# Altium schematic sheet LPCB235 - SPI UART - GROUP B1.SchDoc
size A3; Address1: Factory 10; Address2: 9-13 Dingley Avenue, Dandeong, VICTORIA 3175, AUSTRALIA; DocumentNumber: 36; Revision: 1; SheetNumber: 36; SheetTotal: 37; Lockie__PCB_SUB_ASSEMBLY: SPI UARTS B1; Lockie__PCB_ASSEMBLY: FCU PCB; Lockie__LDL: LPCB235; Lockie__PCB_DESCRIPTION: Flight Control Unit
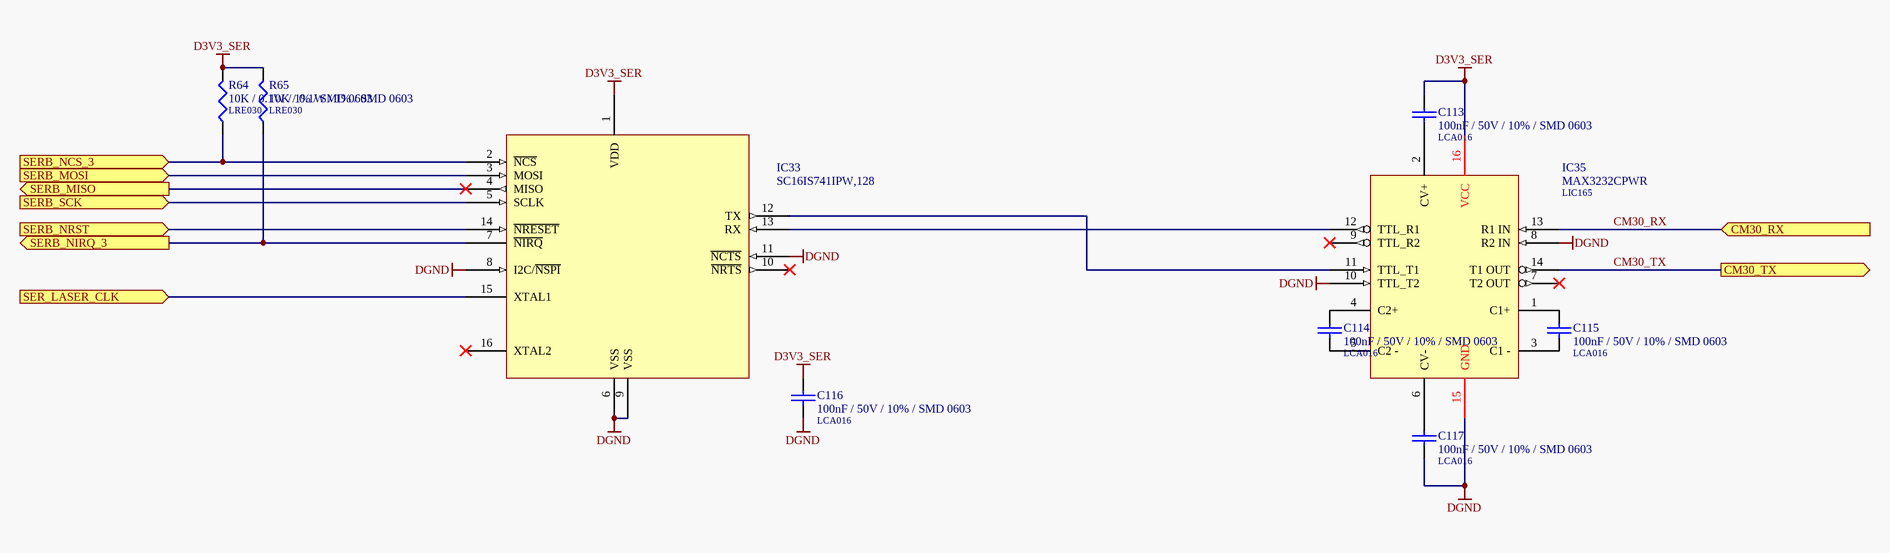
[diagram p0: LPCB235 - SPI UART - GROUP B1.SchDoc]

## Parts
C113  100nF / 50V / 10% / SMD 0603  LDL_NUMBER: LCA016  [LFP011__CC1608-0603-IPC7351_B]
C114  100nF / 50V / 10% / SMD 0603  LDL_NUMBER: LCA016  [LFP011__CC1608-0603-IPC7351_B]
C115  100nF / 50V / 10% / SMD 0603  LDL_NUMBER: LCA016  [LFP011__CC1608-0603-IPC7351_B]
C116  100nF / 50V / 10% / SMD 0603  LDL_NUMBER: LCA016  [LFP011__CC1608-0603-IPC7351_B]
C117  100nF / 50V / 10% / SMD 0603  LDL_NUMBER: LCA016  [LFP011__CC1608-0603-IPC7351_B]
IC33  SC16IS741IPW,128  [LFP049__TSSOP-16]
IC35  MAX3232CPWR  LDL_NUMBER: LIC165  [LFP049__TSSOP-16]
R64  10K / 0.1W / 1% / SMD 0603  LDL_NUMBER: LRE030  [LFP020__CR1608-0603-IPC7351_B]
R65  10K / 0.1W / 1% / SMD 0603  LDL_NUMBER: LRE030  [LFP020__CR1608-0603-IPC7351_B]

## Ports
CM30_RX (in), CM30_TX (out), SER_LASER_CLK (in), SERB_MISO (out), SERB_MOSI (in), SERB_NCS_3 (in), SERB_NIRQ_3 (out), SERB_NRST (in), SERB_SCK (in)

## Nets
D3V3_SER: C113.1 C116.1 IC33.1(VDD) IC35.16(VCC) R64.2 R65.2
DGND: C116.2 C117.2 IC33.6(VSS) IC33.8(I2C/~{NSPI}) IC33.9(VSS) IC33.11(~{NCTS}) IC35.8(R2_IN) IC35.10(TTL_T2) IC35.15(GND)
CM30_RX: IC35.13(R1_IN) ; port CM30_RX
CM30_TX: IC35.14(T1_OUT) ; port CM30_TX
SER_LASER_CLK: IC33.15(XTAL1) ; port SER_LASER_CLK
SERB_MISO: IC33.4(MISO) ; port SERB_MISO
SERB_MOSI: IC33.3(MOSI) ; port SERB_MOSI
SERB_NCS_3: IC33.2(~{NCS}) R64.1 ; port SERB_NCS_3
SERB_NIRQ_3: IC33.7(~{NIRQ}) R65.1 ; port SERB_NIRQ_3
SERB_NRST: IC33.14(~{NRESET}) ; port SERB_NRST
SERB_SCK: IC33.5(SCLK) ; port SERB_SCK
NetC113_2: C113.2 IC35.2(CV+)
NetC114_1: C114.1 IC35.4(C2+)
NetC114_2: C114.2 IC35.5(C2_-)
NetC115_1: C115.1 IC35.1(C1+)
NetC115_2: C115.2 IC35.3(C1_-)
NetC117_1: C117.1 IC35.6(CV-)
NetIC33_12: IC33.12(TX) IC35.11(TTL_T1)
NetIC33_13: IC33.13(RX) IC35.12(TTL_R1)

Not connected (* = marked no-connect by the designer): IC33 10(~{NRTS})* 16(XTAL2)*; IC35 7(T2_OUT)* 9(TTL_R2)*

## Notes on the sheet
- PCB COMPONENT DESCRIPTION
- LDL NUMBER
- Assembly Details
- Size
- Drawing File Name
- Revision
- http://rloop.org
- Scale
- A3
- Sheet Details
- N.T.S
- Sheet:
- Of:

## Library data of the parts
C113-C117 = 100nF / 50V / 10% / SMD 0603: Capacitor, Ceramic Chip, 100nF (0.1uF), 50V, 5%, SMD 0603 [LCA016]; Value: 100n; FMEDA__OPERATING__VOLTAGE_MIN: 0; FMEDA__OPERATING__VOLTAGE_MAX: 3.3; FMEDA__OPERATING__TEMP_MIN: -20; FMEDA__OPERATING__TEMP_TYP: 27; FMEDA__OPERATING__TEMP_MAX: 50; FMEDA__CHANNEL: COM; FMEDA__FUNCTION_IN_SYSTEM: *; FMEDA__OPERATING__VOLTAGE_TYP: 3.3
IC33 = SC16IS741IPW,128: IC, SPI to UART bridge [LIC472]; FMEDA__CHANNEL: COM; LDL_NUMBER: LIC472; FMEDA__FUNCTION_IN_SYSTEM: *
IC35 = MAX3232CPWR: IC, RS232 Line Driver, 3.3V, SMD TSSOP16 [LIC165]; FMEDA__OPERATING__TEMP_MAX: 50; FMEDA__OPERATING__TEMP_MIN: -20; FMEDA__OPERATING__TEMP_TYP: 27; FMEDA__CHANNEL: COM; FMEDA__OPERATING__VOLTAGE_MAX: 3.3; FMEDA__OPERATING__VOLTAGE_MIN: 0; FMEDA__FUNCTION_IN_SYSTEM: *; FMEDA__OPERATING__VOLTAGE_TYP: 3.3
R64 R65 = 10K / 0.1W / 1% / SMD 0603: Resistor, Ceramic Chip, 10K, 0.1W, 1%, SMD 0603 [LRE030]; FMEDA__OPERATING__POWER_MAX: 0; FMEDA__OPERATING__TEMP_MAX: 50; FMEDA__OPERATING__TEMP_MIN: -20; FMEDA__OPERATING__TEMP_TYP: 27; FMEDA__CHANNEL: COM; Value: 10K; FMEDA__OPERATING__POWER_MIN: 0; FMEDA__OPERATING__VOLTAGE_MAX: 0; FMEDA__OPERATING__VOLTAGE_MIN: 0; FMEDA__OPERATING__VOLTAGE_TYP: 0; FMEDA__FUNCTION_IN_SYSTEM: *